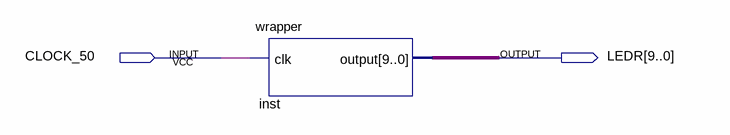
[diagram p0: schematic sheet]
// Quartus schematic wrapper_block.bdf as structural Verilog: 1 symbols, 2 pins
module wrapper_block (
  input  CLOCK_50,
  output [9:0] LEDR
);

  wrapper inst (.clk(CLOCK_50), .\output (LEDR));
endmodule
